# Altium project CPAP_HeatedBed.PrjPcb
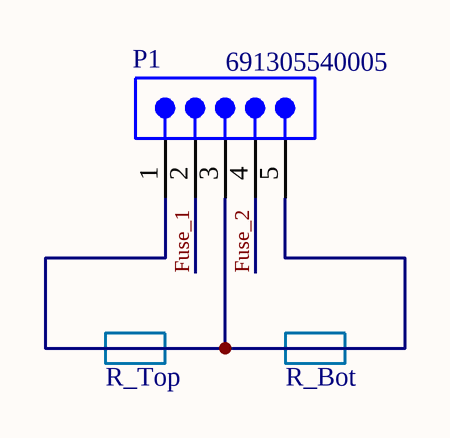
[diagram p0: HeatedBed.SchDoc]
1 sheet, 1 parts. Net scope: global (net labels, ports and power ports of the same name join across sheets).
Board files: PcbDesign.PcbDoc, PCB_modified.PcbDoc, PCB_Bigger.PcbDoc

## Sheet HeatedBed.SchDoc
size A4; Author: Fabian Castaño; CompanyName: GIBIC Tech-Hub; Engineer: Fabian Castaño; Organization: Universidad de Antioquia; Address1: UdeA; Address2: Medellín; Address3: Antioquia; Address4: Colombia 050010

### Parts
P1  691305540005  [691305540005]

### Nets
Fuse_1: P1.2
Fuse_2: P1.4
NetP1_1: P1.1 P1.3 P1.5

### Notes on the sheet
- R_Top
- R_Bot
- Title
- Size:
- Date:
- A4
- Enginner:
- Time:
- Revision:
- Sheet
- of
- Author:
- File:

### Library data of the parts
P1 = CMP-03913-99613978-1: 691305540005 Terminal Block, R/A Header, 5Pos, Th Rohs Compliant: Yes; NexarPartId: 99613978